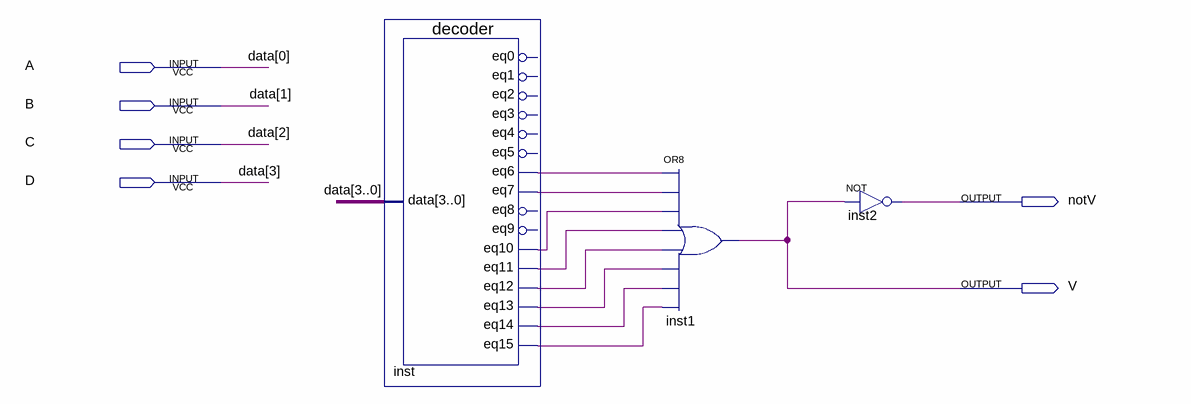
[diagram p0: schematic sheet]
// Quartus schematic c3.bdf as structural Verilog: 3 symbols, 6 pins
module c3 (
  input  A,
  input  B,
  input  C,
  input  D,
  output notV,
  output V
);

  wire inst_eq6, inst_eq7, inst_eq10, inst_eq11, inst_eq12, inst_eq13, inst_eq14, inst_eq15;

  decoder inst (
    .data({D, C, B, A}), .eq10(inst_eq10), .eq11(inst_eq11), .eq12(inst_eq12), .eq13(inst_eq13),
    .eq14(inst_eq14), .eq15(inst_eq15), .eq6(inst_eq6), .eq7(inst_eq7));  // open: eq0, eq1, eq2, eq3, eq4, eq5, eq8, eq9
  or inst1 (V, inst_eq6, inst_eq7, inst_eq10, inst_eq11, inst_eq12, inst_eq13, inst_eq14, inst_eq15);
  not inst2 (notV, V);

  // Other names for the same wires on the sheet: data[3:0] = {D, C, B, A}
endmodule
